# Altium schematic sheet 3 - SRAM.SchDoc
size 386 x 246 mm
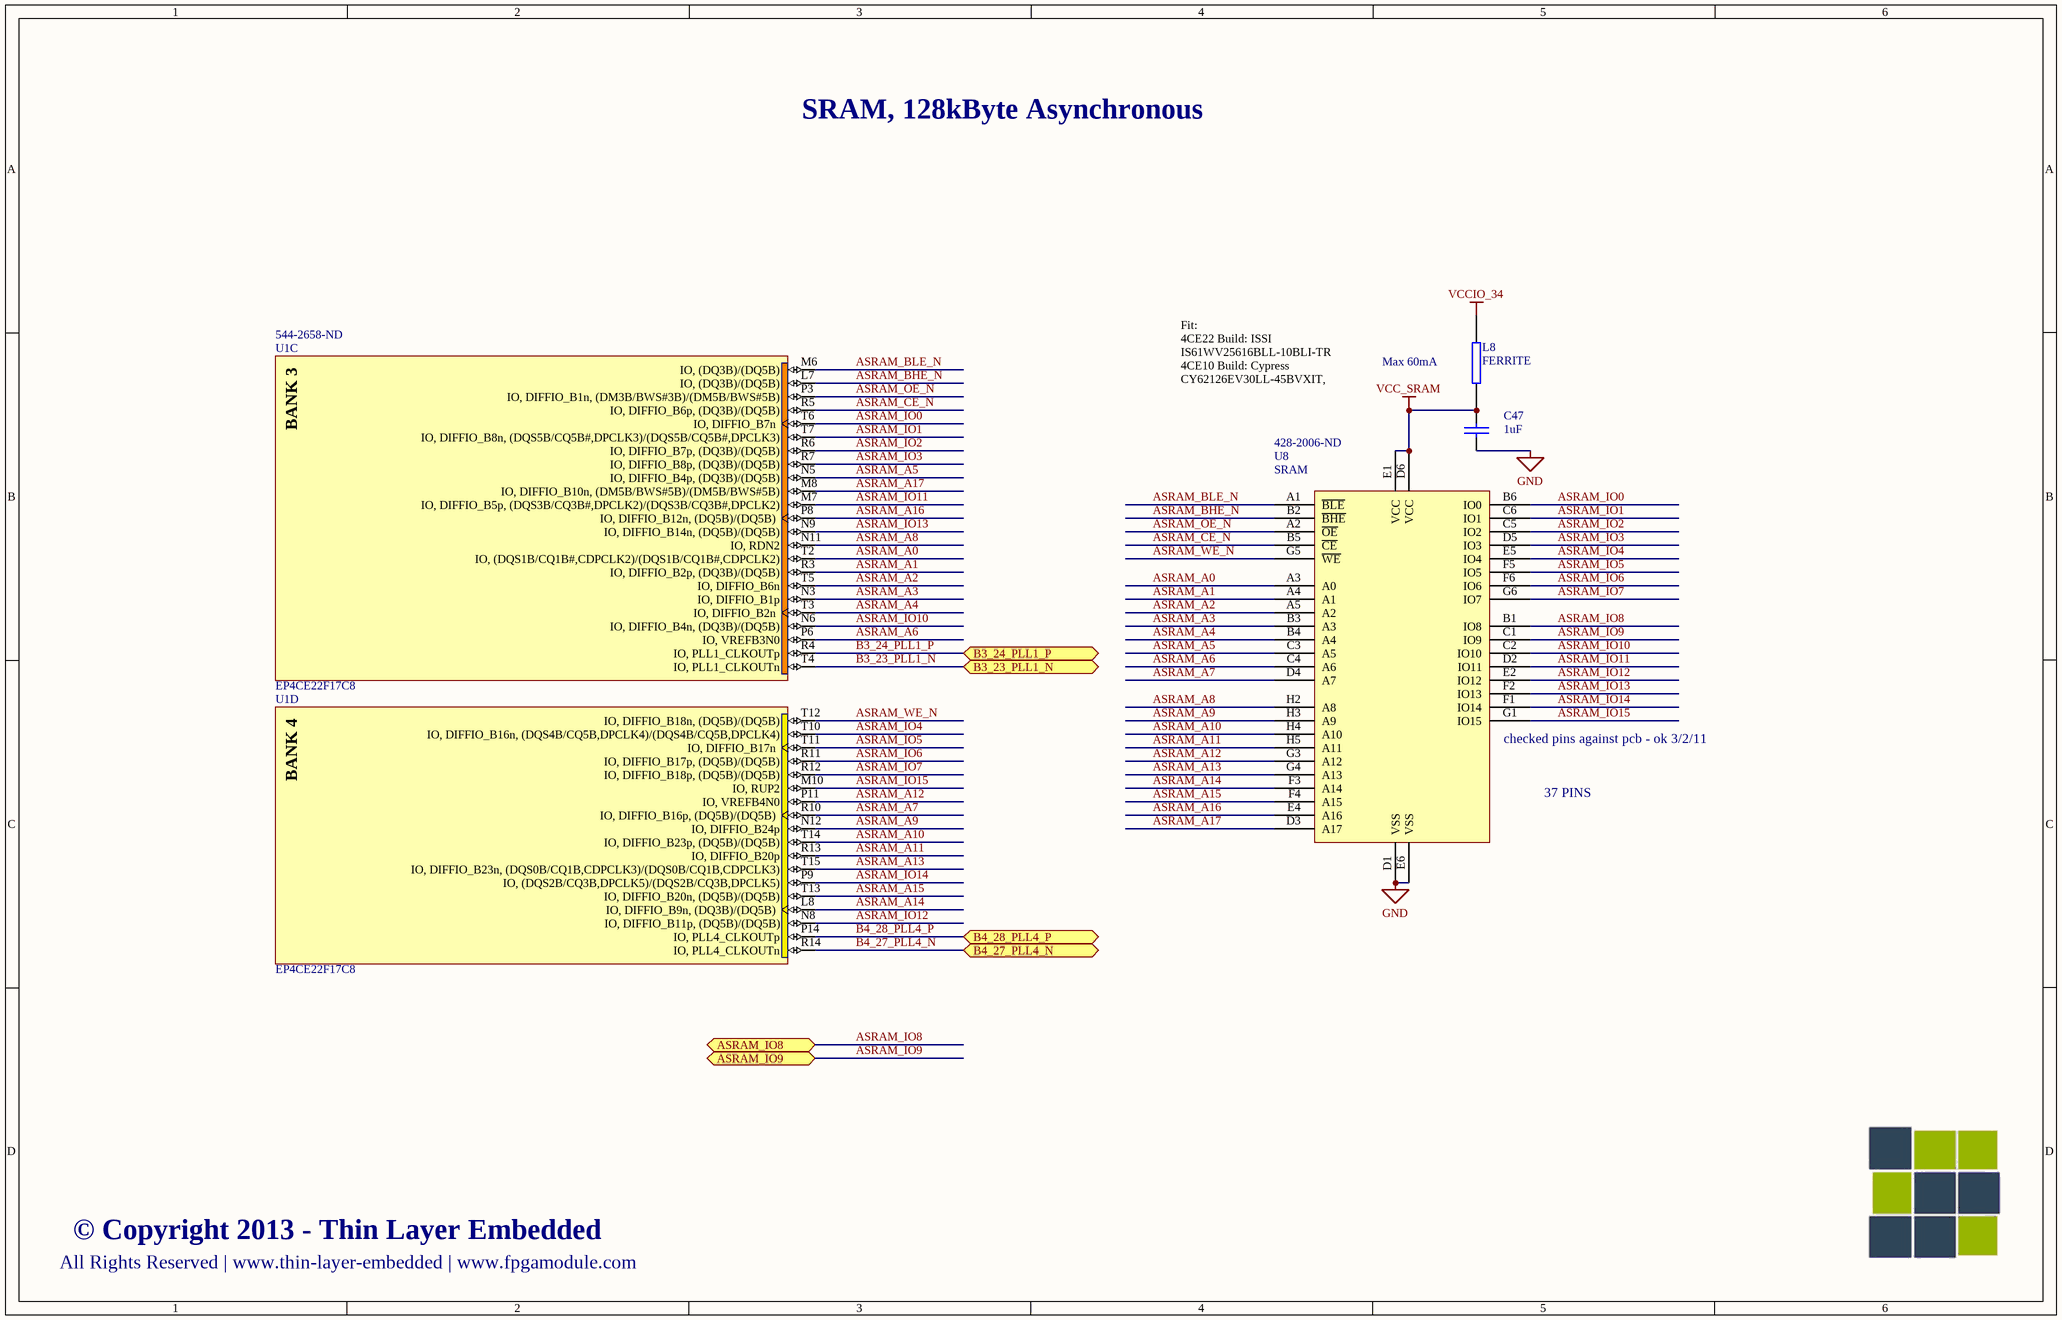
[diagram p0: 3 - SRAM.SchDoc]

## Parts
C47  1uF  [0402_HD]
L8  FERRITE  [0402_HD]
U1  EP4CE22F17C8  Supplier Part Number 1: 544-2658-ND  [FBGA256]  (parts C,D of 13)
U8  SRAM  Supplier Part Number 1: 428-2006-ND  [VFBGA48]

## Ports
ASRAM_IO8, ASRAM_IO9, B3_23_PLL1_N, B3_24_PLL1_P, B4_27_PLL4_N, B4_28_PLL4_P

## Nets
GND: C47.2 U8.D1(VSS) U8.E6(VSS)
VCC_SRAM: C47.1 L8.1 U8.D6(VCC) U8.E1(VCC)
VCCIO_34: L8.2
ASRAM_A0: U1.T2(IO,_(DQS1B/CQ1B#,CDPCLK2)/(DQS1B/CQ1B#,CDPCLK2)) U8.A3(A0)
ASRAM_A1: U1.R3(IO,_DIFFIO_B2p,_(DQ3B)/(DQ5B)) U8.A4(A1)
ASRAM_A2: U1.T5(IO,_DIFFIO_B6n) U8.A5(A2)
ASRAM_A3: U1.N3(IO,_DIFFIO_B1p) U8.B3(A3)
ASRAM_A4: U1.T3(IO,_DIFFIO_B2n) U8.B4(A4)
ASRAM_A5: U1.N5(IO,_DIFFIO_B4p,_(DQ3B)/(DQ5B)) U8.C3(A5)
ASRAM_A6: U1.P6(IO,_VREFB3N0) U8.C4(A6)
ASRAM_A7: U1.R10(IO,_DIFFIO_B16p,_(DQ5B)/(DQ5B)) U8.D4(A7)
ASRAM_A8: U1.N11(IO,_RDN2) U8.H2(A8)
ASRAM_A9: U1.N12(IO,_DIFFIO_B24p) U8.H3(A9)
ASRAM_A10: U1.T14(IO,_DIFFIO_B23p,_(DQ5B)/(DQ5B)) U8.H4(A10)
ASRAM_A11: U1.R13(IO,_DIFFIO_B20p) U8.H5(A11)
ASRAM_A12: U1.P11(IO,_VREFB4N0) U8.G3(A12)
ASRAM_A13: U1.T15(IO,_DIFFIO_B23n,_(DQS0B/CQ1B,CDPCLK3)/(DQS0B/CQ1B,CDPCLK3)) U8.G4(A13)
ASRAM_A14: U1.L8(IO,_DIFFIO_B9n,_(DQ3B)/(DQ5B)) U8.F3(A14)
ASRAM_A15: U1.T13(IO,_DIFFIO_B20n,_(DQ5B)/(DQ5B)) U8.F4(A15)
ASRAM_A16: U1.P8(IO,_DIFFIO_B12n,_(DQ5B)/(DQ5B)) U8.E4(A16)
ASRAM_A17: U1.M8(IO,_DIFFIO_B10n,_(DM5B/BWS#5B)/(DM5B/BWS#5B)) U8.D3(A17)
ASRAM_BHE_N: U1.L7(IO,_(DQ3B)/(DQ5B)) U8.B2(~{BHE})
ASRAM_BLE_N: U1.M6(IO,_(DQ3B)/(DQ5B)) U8.A1(~{BLE})
ASRAM_CE_N: U1.R5(IO,_DIFFIO_B6p,_(DQ3B)/(DQ5B)) U8.B5(~{CE})
ASRAM_IO0: U1.T6(IO,_DIFFIO_B7n) U8.B6(IO0)
ASRAM_IO1: U1.T7(IO,_DIFFIO_B8n,_(DQS5B/CQ5B#,DPCLK3)/(DQS5B/CQ5B#,DPCLK3)) U8.C6(IO1)
ASRAM_IO2: U1.R6(IO,_DIFFIO_B7p,_(DQ3B)/(DQ5B)) U8.C5(IO2)
ASRAM_IO3: U1.R7(IO,_DIFFIO_B8p,_(DQ3B)/(DQ5B)) U8.D5(IO3)
ASRAM_IO4: U1.T10(IO,_DIFFIO_B16n,_(DQS4B/CQ5B,DPCLK4)/(DQS4B/CQ5B,DPCLK4)) U8.E5(IO4)
ASRAM_IO5: U1.T11(IO,_DIFFIO_B17n) U8.F5(IO5)
ASRAM_IO6: U1.R11(IO,_DIFFIO_B17p,_(DQ5B)/(DQ5B)) U8.F6(IO6)
ASRAM_IO7: U1.R12(IO,_DIFFIO_B18p,_(DQ5B)/(DQ5B)) U8.G6(IO7)
ASRAM_IO8: U8.B1(IO8) ; port ASRAM_IO8
ASRAM_IO9: U8.C1(IO9) ; port ASRAM_IO9
ASRAM_IO10: U1.N6(IO,_DIFFIO_B4n,_(DQ3B)/(DQ5B)) U8.C2(IO10)
ASRAM_IO11: U1.M7(IO,_DIFFIO_B5p,_(DQS3B/CQ3B#,DPCLK2)/(DQS3B/CQ3B#,DPCLK2)) U8.D2(IO11)
ASRAM_IO12: U1.N8(IO,_DIFFIO_B11p,_(DQ5B)/(DQ5B)) U8.E2(IO12)
ASRAM_IO13: U1.N9(IO,_DIFFIO_B14n,_(DQ5B)/(DQ5B)) U8.F2(IO13)
ASRAM_IO14: U1.P9(IO,_(DQS2B/CQ3B,DPCLK5)/(DQS2B/CQ3B,DPCLK5)) U8.F1(IO14)
ASRAM_IO15: U1.M10(IO,_RUP2) U8.G1(IO15)
ASRAM_OE_N: U1.P3(IO,_DIFFIO_B1n,_(DM3B/BWS#3B)/(DM5B/BWS#5B)) U8.A2(~{OE})
ASRAM_WE_N: U1.T12(IO,_DIFFIO_B18n,_(DQ5B)/(DQ5B)) U8.G5(~{WE})
B3_23_PLL1_N: U1.T4(IO,_PLL1_CLKOUTn) ; port B3_23_PLL1_N
B3_24_PLL1_P: U1.R4(IO,_PLL1_CLKOUTp) ; port B3_24_PLL1_P
B4_27_PLL4_N: U1.R14(IO,_PLL4_CLKOUTn) ; port B4_27_PLL4_N
B4_28_PLL4_P: U1.P14(IO,_PLL4_CLKOUTp) ; port B4_28_PLL4_P

## Notes on the sheet
- SRAM, 128kByte Asynchronous
- Max 60mA
- Fit:
  4CE22 Build: ISSI IS61WV25616BLL-10BLI-TR
  4CE10 Build: Cypress CY62126EV30LL-45BVXIT,
- (near U8) checked pins against pcb - ok 3/2/11
- 37 PINS
- All Rights Reserved | www.thin-layer-embedded | www.fpgamodule.com
- © Copyright 2013 - Thin Layer Embedded
- (in symbol EP4CE22F17C8, part C) BANK 3
- (in symbol EP4CE22F17C8, part D) BANK 4

## Library data of the parts
C47 = CAP: Capacitor; Manufacturer: Yageo; Manufacturer Part Number: CC0402ZRY5V8BB104; Description: CAP CERAMIC .1UF 25V Y5V 0402; Capacitance: 0.1µF; Voltage - Rated: 25V; Tolerance: -20%, +80%; Temperature Coefficient: Y5V (F); Supplier 1: Digi-Key; Supplier 2: Digi-Key; RoHS: RoHS Compliant; Category: Capacitors; Stock 2: 808472; Pricing 2: 10=0.023, 100=0.0135, 500=0.0072, 1000=0.00488 (USD); Mounting Type: Surface Mount, MLCC; Operating Temperature: -30°C ~ 85°C; Applications: General Purpose; Ratings: -; Package / Case: 0402 (1005 Metric); Size / Dimension: 0.039" L x 0.020" W (1.00mm x 0.50mm); Height: -; Thickness: 0.020" (0.50mm); Lead Spacing: -; Features: -; Packaging: Cut Tape (CT); Lead Style: -; ComponentLink1URL: http://media.digikey.com/pdf/Data%20Sheets/Yageo%20PDFs/MLCC%20ordering%20code.pdf; ComponentLink1Description: http://media.digikey.com/pdf/Data%20Sheets/Yageo%20PDFs/MLCC%20ordering%20code.pdf; Supplier 3: Digi-Key; Supplier Part Number 3: 587-1231-2-ND
U1 = EP4CE22F17C8: Cyclone IV Family FPGA, 2V Core, 153 I/O Pins, 4 PLLs, 256-Pin FBGA, Speed Grade 8, Commercial Grade; Manufacturer: Altera; Manufacturer Part Number: EP4CE22F17C7N; Description: IC CYCLONE IV E FPGA 22K 256FBGA; Number of Logic Elements/Cells: 22320; Number of LABs/CLBs: 1395; Total RAM Bits: 608256; Number of I /O: 153; Voltage - Supply: 1.15 V ~ 1.25 V; Published: 3-May-2010; DatasheetVersion: ver1.2, Mar-2010; PackageVersion: ver16.0, Dec-2009; PackageReference: FBGA256; Publisher: Altium Limited; PackageDescription: 256-Ball FineLine Ball Grid Array (FBGA256) - Option 1 - Wire Bond; Code_JEDEC: MS-034-AAF-1; Code_IPC: BGA100P16X16-256; ComponentLink1Description: Manufacturer Link; ComponentLink1URL: http://www.altera.com/; ComponentLink2Description: Handbook; ComponentLink2URL: http://www.altera.com/literature/hb/cyclone-iv/cyclone4-handbook.pdf; ComponentLink3Description: Pinout Specification; ComponentLink3URL: http://www.altera.com/literature/lit-dp.jsp?category=cyc%204&showspreadsheet=y; ComponentLink4Description: Packaging Specification; ComponentLink4URL: http://www.altera.com/literature/ds/dspkg.pdf; Supplier 1: Digi-Key; RoHS: RoHS Compliant; Category: Integrated Circuits (ICs); Stock 1: 6; Pricing 1: 1=55.5 (USD); Number of Gates: -; Mounting Type: Surface Mount; Operating Temperature: 0°C ~ 85°C; Package / Case: 256-BGA; Supplier Device Package: 256-FBGA (17x17)
U8 = CY7C1021DV331: Manufacturer: Cypress Semiconductor Corp; Manufacturer Part Number: CY7C1021DV33-10BVXI; Description: IC SRAM 1MBIT 10NS 48VFBGA; Format - Memory: RAM; Memory Type: SRAM - Asynchronous; Memory Size: 1M (64K x 16); Speed: 10ns; Interface: Parallel; Voltage - Supply: 3 V ~ 3.6 V; Supplier 1: Digi-Key; RoHS: RoHS Compliant; Category: Integrated Circuits (ICs); Stock 1: 1470; Pricing 1: 1=2.64, 25=2.28, 100=2.16, 250=1.8, 500=1.74, 750=1.68, 1000=1.62, 2500=1.56, 5000=1.53 (USD); Operating Temperature: -40°C ~ 85°C; Package / Case: 48-VFBGA; Supplier Device Package: 48-VFBGA (6x8); Packaging: Tray; ComponentLink1URL: http://www.cypress.com/?docID=25628; ComponentLink1Description: http://www.cypress.com/?docID=25628